# Altium schematic sheet Schematic.SchDoc
size A3; SheetNumber: 1; SheetTotal: 1
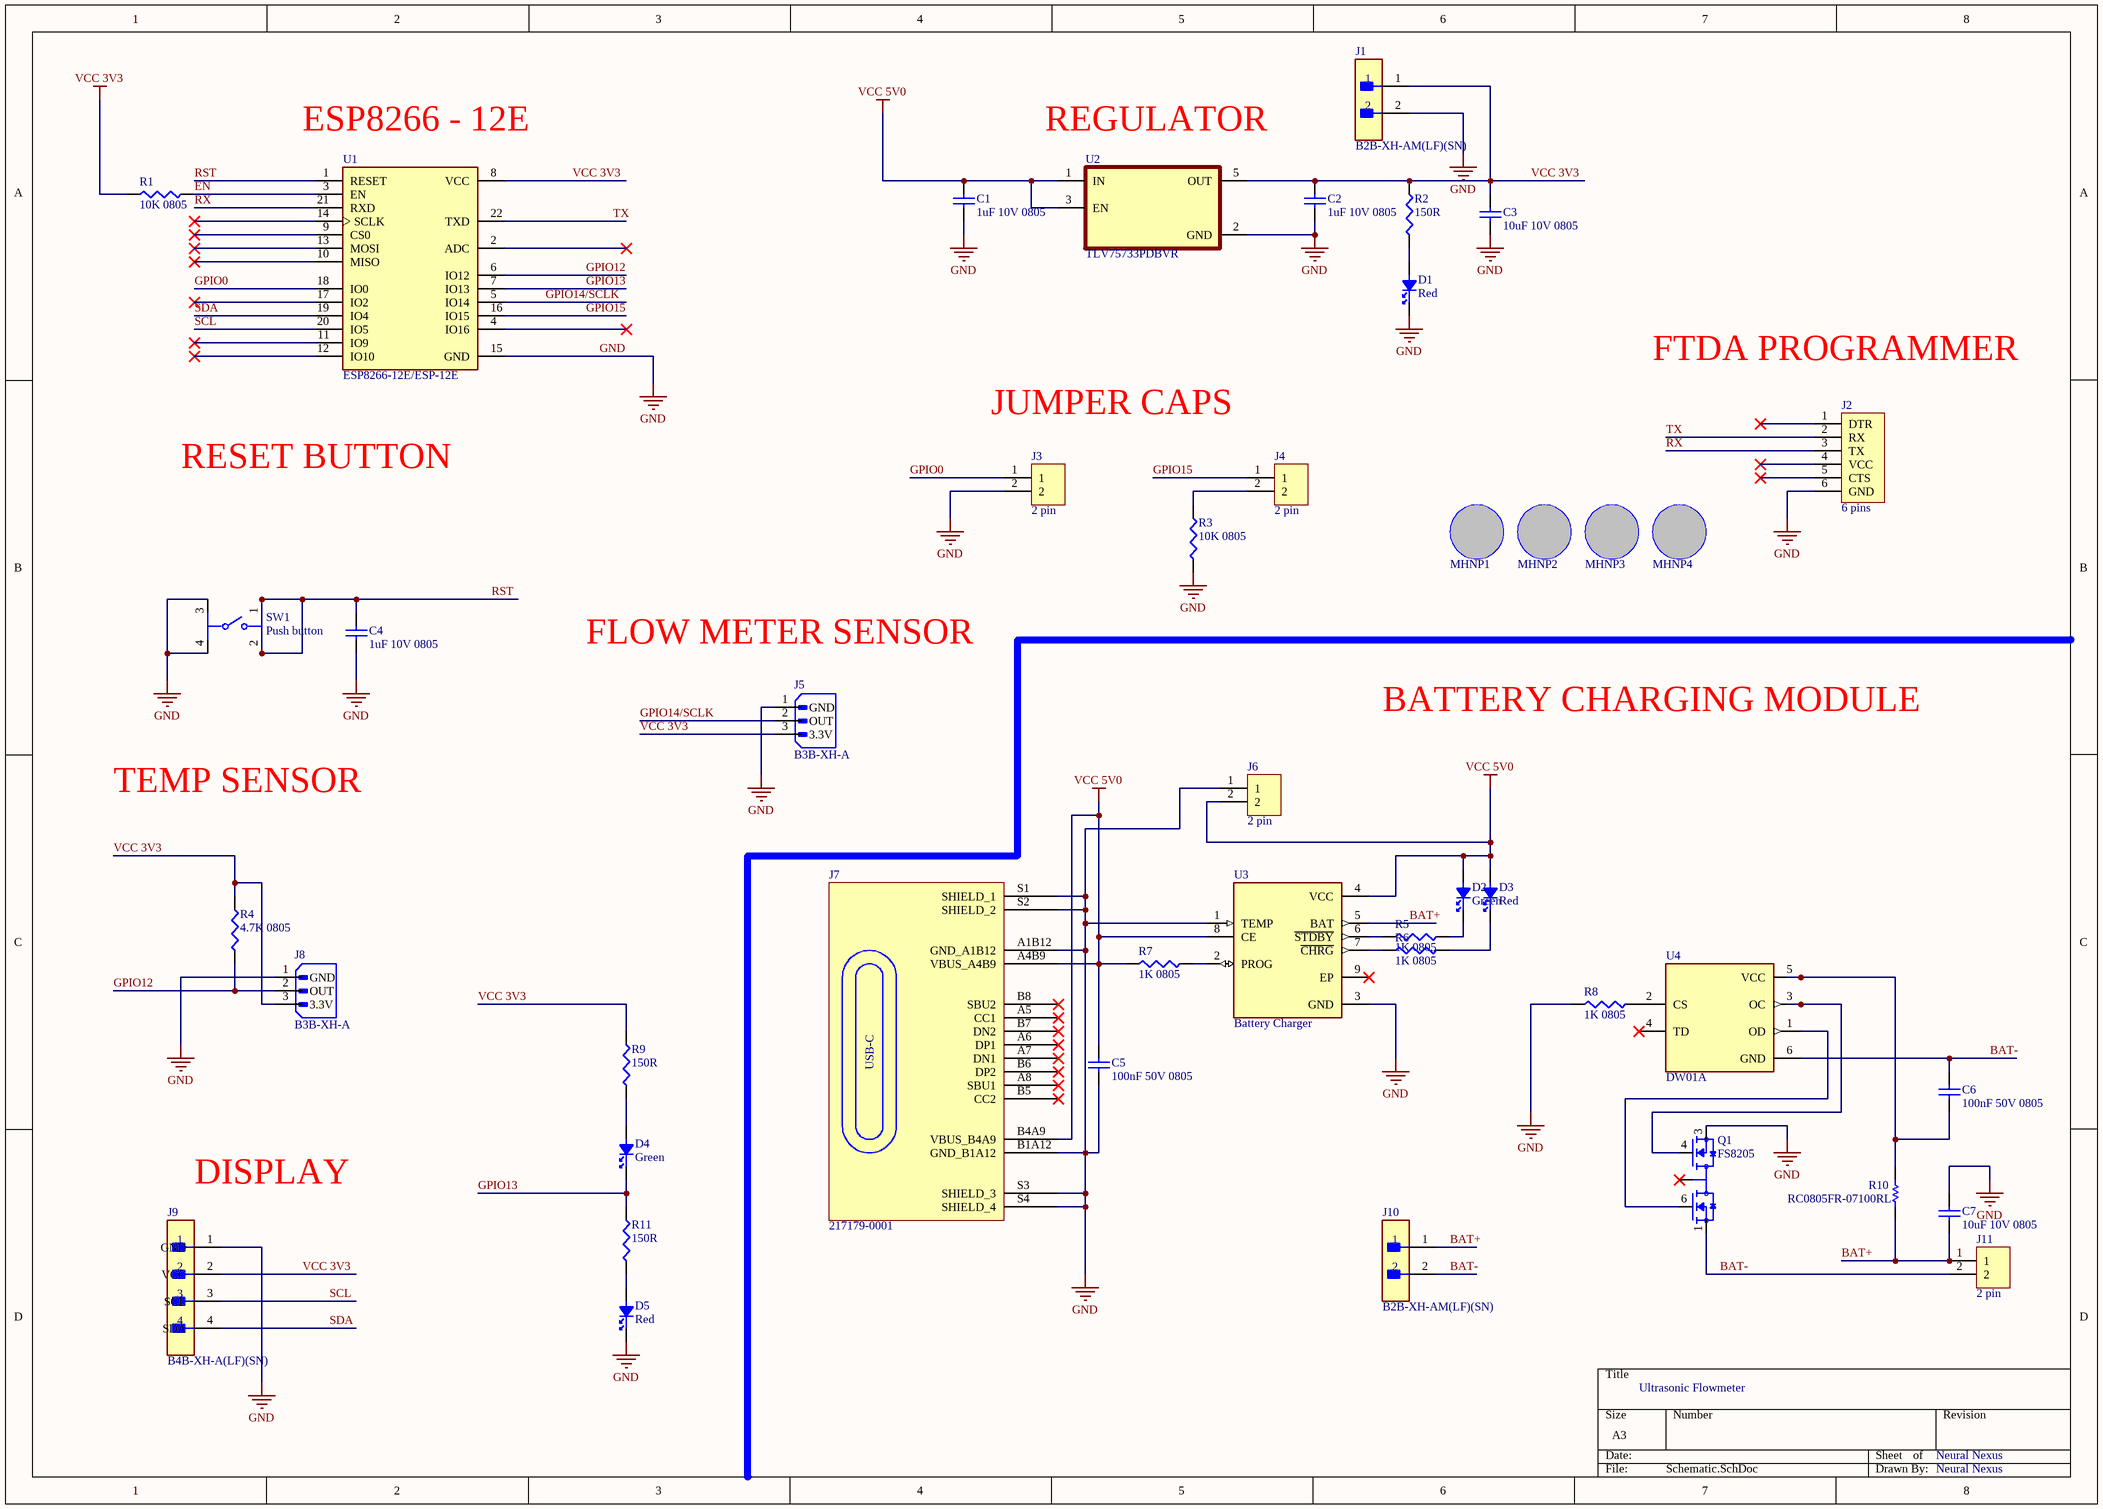
[diagram p0: Schematic.SchDoc]

## Parts
C1  1uF 10V 0805  [CAPC2012X140N]
C2  1uF 10V 0805  [CAPC2012X140N]
C3  10uF 10V 0805  [CAPC2012X140N]
C4  1uF 10V 0805  [CAPC2012X140N]
C5  100nF 50V 0805  [FP-CC0805-0_85-IPC_A]
C6  100nF 50V 0805  [FP-CC0805-0_85-IPC_A]
C7  10uF 10V 0805  [CAPC2012X140N]
D1  Red  [WL-SMCW_1206_150120xx75000 - duplicate]
D2  Green  [WL-SMCW_1206_150120xx75000]
D3  Red  [WL-SMCW_1206_150120xx75000 - duplicate]
D4  Green  [WL-SMCW_1206_150120xx75000]
D5  Red  [WL-SMCW_1206_150120xx75000 - duplicate]
J1  B2B-XH-AM(LF)(SN)  [FP-B2B-XH-AM_LF_SN-MFG]
J2  6 pins  [61300611121]
J3  2 pin  [61300211121]
J4  2 pin  [61300211121]
J5  B3B-XH-A  [JST_B3B-XH-A]
J6  2 pin  [61300211121]
J7  217179-0001  [FP-2171790001-MFG]
J8  B3B-XH-A  [JST_B3B-XH-A]
J9  B4B-XH-A(LF)(SN)  [FP-B4B-XH-A_LF_SN-MFG]
J10  B2B-XH-AM(LF)(SN)  [FP-B2B-XH-AM_LF_SN-MFG]
J11  2 pin  [61300211121]
MHNP1  Mounting Hole Non plated 3.2mm  [MTHNP3P2MM]  (value not drawn)
MHNP2  Mounting Hole Non plated 3.2mm  [MTHNP3P2MM]  (value not drawn)
MHNP3  Mounting Hole Non plated 3.2mm  [MTHNP3P2MM]  (value not drawn)
MHNP4  Mounting Hole Non plated 3.2mm  [MTHNP3P2MM]  (value not drawn)
Q1  FS8205  [SOT95P280X145-6N]
R1  10K 0805  [RESC2012X65N]
R2  150R  [RESC2012X60N]
R3  10K 0805  [RESC2012X65N]
R4  4.7K 0805  [FP-CRGCQ0805-IPC_A]
R5  1K 0805  [RESC2013X60X35NL10T20]
R6  1K 0805  [RESC2013X60X35NL10T20]
R7  1K 0805  [RESC2013X60X35NL10T20]
R8  1K 0805  [RESC2013X60X35NL10T20]
R9  150R  [RESC2012X60N]
R10  RC0805FR-07100RL  [RESC2013X60X35NL10T20]
R11  150R  [RESC2012X60N]
SW1  Push button  [FP-PTS645SH50SMTR92LFS-MFG]
U1  ESP8266-12E/ESP-12E  [XCVR_ESP8266-12E/ESP-12E]
U2  TLV75733PDBVR  [SOT95P280X145-5N]
U3  Battery Charger  [SOP127P600X175-9N]
U4  DW01A  [SOT95P280X145-6N - duplicate]

## Nets
GND: C1.1 C2.1 C3.1 C4.1 C5.1 C7.2 D1.1 D5.1 J1.2 J2.6(GND) J3.2 J5.1(GND) J6.1 J7.A1B12(GND_A1B12) J7.B1A12(GND_B1A12) J7.S1(SHIELD_1) J7.S2(SHIELD_2) J7.S3(SHIELD_3) J7.S4(SHIELD_4) J8.1(GND) J9.1(GND) Q1.3(S2) R3.1 R8.1 SW1.3 SW1.4 U1.15(GND) U2.2(GND) U3.1(TEMP) U3.3(GND)
VCC 3V3: C2.2 C3.2 J1.1 J5.3(3.3V) J8.3(3.3V) J9.2(VCC) R1.1 R2.2 R4.2 R9.2 U1.8(VCC) U2.5(OUT)
VCC 5V0: C1.2 C5.2 D2.2 D3.2 J6.2 J7.A4B9(VBUS_A4B9) J7.B4A9(VBUS_B4A9) R7.1 U2.1(IN) U2.3(EN) U3.4(VCC) U3.8(CE)
BAT+: C7.1 J10.1 J11.1 R10.1 U3.5(BAT)
BAT-: C6.2 J10.2 J11.2 Q1.1(S1) U4.6(GND)
EN: R1.2 U1.3(EN)
GPIO0: J3.1 U1.18(IO0)
GPIO12: J8.2(OUT) R4.1 U1.6(IO12)
GPIO13: D4.1 R11.2 U1.7(IO13)
GPIO14/SCLK: J5.2(OUT) U1.5(IO14)
GPIO15: J4.1 U1.16(IO15)
RST: C4.2 SW1.1 SW1.2 U1.1(RESET)
RX: J2.3(TX) U1.21(RXD)
SCL: J9.3(SCL) U1.20(IO5)
SDA: J9.4(SDA) U1.19(IO4)
TX: J2.2(RX) U1.22(TXD)
NetC6_1: C6.1 R10.2 U4.5(VCC)
NetD1_2: D1.2 R2.1
NetD2_1: D2.1 R5.2
NetD3_1: D3.1 R6.2
NetD4_2: D4.2 R9.1
NetD5_2: D5.2 R11.1
NetJ4_2: J4.2 R3.2
NetQ1_2: Q1.2(D12) Q1.5(D12)
NetQ1_4: Q1.4(G2) U4.3(OC)
NetQ1_6: Q1.6(G1) U4.1(OD)
NetR5_1: R5.1 U3.6(~{STDBY})
NetR6_1: R6.1 U3.7(~{CHRG})
NetR7_2: R7.2 U3.2(PROG)
NetR8_2: R8.2 U4.2(CS)

Not connected (* = marked no-connect by the designer): J2 1(DTR)* 4(VCC)* 5(CTS)*; J7 A5(CC1)* A6(DP1)* A7(DN1)* A8(SBU1)* B5(CC2)* B6(DP2)* B7(DN2)* B8(SBU2)*; U1 2(ADC)* 4(IO16)* 9(CS0)* 10(MISO)* 11(IO9)* 12(IO10)* 13(MOSI)* 14(SCLK)* 17(IO2)*; U3 9(EP)*; U4 4(TD)*

## Notes on the sheet
- (near U1) ESP8266 - 12E
- (near U2) REGULATOR
- FTDA PROGRAMMER
- JUMPER CAPS
- RESET BUTTON
- FLOW METER SENSOR
- BATTERY CHARGING MODULE
- TEMP SENSOR
- DISPLAY
- Ultrasonic Flowmeter
- Neural Nexus
- (in symbol 217179-0001) USB-C

## Library data of the parts
C1 C2 C4 = CL21B105KPFNNNE: CCAP CER 1UF 10V X7R 0805; Manufacturer: Samsung; Dielectric Material: Ceramic; Multilayer: Yes; Tolerance  (fill in as +-): 10%; Supplier: Digikey; Supplier Part Number: 1276-1275-1-ND; Manufacturer Part Number: CL21B105KPFNNNE; RoHS: Yes; Category: Ceramic Capacitors; Stock: 563518; Pricing: 1=0.1, 10=0.041, 100=0.0237, 1000=0.0151 (USD); Mounting Technology: Surface Mount; Pins: 2; Package Shape: Rectangular; Case/Package: 0805; Terminal Finish: Nickel; Min Operating Temperature: -55°C; Max Operating Temperature: 125°C; JESD-609 Code: e3; Value: 1uF; Capacitor Type: Ceramic; Package Style: SMTMeter; Packaging: Tape and Reel; Tolerance (fill in as +-): 10%; Rated DC Voltage (URdc): 10V; Temperature Characteristics Code: X7R; Termination: Wraparound; Length: 2mm; Width: 1.25mm; Height: 1.35mm; Reach SVHC Compliant: Yes; RoHS Compliant: Yes; ComponentLink1URL: https://datasheet.ciiva.com:443/pdfs/VipMasterIC/IC/SEMS/SEMS-S-A0008523501/SEMS-S-A0008523532-1.pdf?src-supplier=IHS+Markit; ComponentLink1Description: https://datasheet.ciiva.com:443/pdfs/VipMasterIC/IC/SEMS/SEMS-S-A0008523501/SEMS-S-A0008523532-1.pdf?src-supplier=IHS+Markit; ComponentLink2URL: https://datasheet.ciiva.com/25799/cl21b105kpfnnne-25799843.pdf?src-supplier=Digikey; ComponentLink2Description: https://datasheet.ciiva.com/25799/cl21b105kpfnnne-25799843.pdf?src-supplier=Digikey; ComponentLink3URL: https://datasheet.ciiva.com/26838/getdatasheetpartid-358362-26838675.pdf?src-supplier=Verical; ComponentLink3Description: https://datasheet.ciiva.com/26838/getdatasheetpartid-358362-26838675.pdf?src-supplier=Verical; ComponentLink4URL: https://datasheet.ciiva.com/16384/cl05b104kq5nnnc-16384501.pdf?src-supplier=Future+Electronics; ComponentLink4Description: https://datasheet.ciiva.com/16384/cl05b104kq5nnnc-16384501.pdf?src-supplier=Future+Electronics
C3 C7 = CL21B106KPQNNNE: Ceramic Capacitor, Multilayer, Ceramic, 10V, 10% +Tol, 10% -Tol, X7R, 15% TC, 10uF, Surface Mount, 0805; Manufacturer: Samsung; Multilayer: Yes; Supplier: Digikey; Supplier Part Number: 1276-1764-1-ND; Manufacturer Part Number: CL21B106KPQNNNE; RoHS: Yes; Category: Ceramic Capacitors; Stock: 679901; Pricing: 1=0.08, 10=0.03, 100=0.0256, 1000=0.02281 (USD); Mounting Technology: Surface Mount; Pins: 2; Dielectric Material: Ceramic; Package Shape: Rectangular; Case/Package: 0805; Terminal Finish: Nickel; Min Operating Temperature: -55°C; Max Operating Temperature: 125°C; JESD-609 Code: e3; Value: 10uF; Capacitor Type: Ceramic; Tolerance  (fill in as +-): 10%; Package Style: SMTMeter; Packaging: Tape and Reel; Tolerance (fill in as +-): 10%; Rated DC Voltage (URdc): 10V; Temperature Characteristics Code: X7R; Termination: Wraparound; Length: 2mm; Width: 1.25mm; Height: 1.4mm; Reach SVHC Compliant: Yes; RoHS Compliant: Yes; ComponentLink1URL: https://datasheet.ciiva.com:443/pdfs/VipMasterIC/IC/SEMS/SEMS-S-A0008384515/SEMS-S-A0008873201-1.pdf?src-supplier=IHS+Markit; ComponentLink1Description: https://datasheet.ciiva.com:443/pdfs/VipMasterIC/IC/SEMS/SEMS-S-A0008384515/SEMS-S-A0008873201-1.pdf?src-supplier=IHS+Markit; ComponentLink2URL: https://datasheet.ciiva.com/25794/cl21b106kpqnnne-25794947.pdf?src-supplier=Digikey; ComponentLink2Description: https://datasheet.ciiva.com/25794/cl21b106kpqnnne-25794947.pdf?src-supplier=Digikey
C5 C6 = CC0805KRX7R9BB104: CAP CER 0.1UF 50V X7R 0805; Manufacturer: Yageo; Dielectric Material: Ceramic; Multilayer: Yes; Tolerance  (fill in as +-): 10%; Supplier: Digikey; Supplier Part Number: 311-1140-1-ND; Manufacturer Part Number: CC0805KRX7R9BB104; RoHS: Yes; Category: Ceramic Capacitors; Stock: 2500824; Pricing: 1=0.08, 10=0.027, 100=0.0192, 1000=0.0136 (USD); Mounting Technology: Surface Mount; Pins: 2; Package Shape: Rectangular; Case/Package: 0805; Terminal Finish: Nickel; Min Operating Temperature: -55°C; Max Operating Temperature: 125°C; JESD-609 Code: e3; Value: 100nF; Capacitor Type: Ceramic; Package Style: SMTMeter; Packaging: Tape and Reel; Tolerance (fill in as +-): 10%; Rated DC Voltage (URdc): 50V; Temperature Characteristics Code: X7R; Termination: Wraparound; Length: 2mm; Width: 1.25mm; Height: 0.85mm; Reach SVHC Compliant: Yes; RoHS Compliant: Yes; ComponentLink1URL: https://datasheet.ciiva.com:443/pdfs/VipMasterIC/IC/YAGO/YAGO-S-A0003557223/YAGO-S-A0003557223-1.pdf?src-supplier=IHS+Markit; ComponentLink1Description: https://datasheet.ciiva.com:443/pdfs/VipMasterIC/IC/YAGO/YAGO-S-A0003557223/YAGO-S-A0003557223-1.pdf?src-supplier=IHS+Markit; ComponentLink2URL: https://datasheet.ciiva.com/11786/0900766b80d84f1d-11786009.pdf?src-supplier=Rs; ComponentLink2Description: https://datasheet.ciiva.com/11786/0900766b80d84f1d-11786009.pdf?src-supplier=Rs; ComponentLink3URL: https://datasheet.ciiva.com/11464/upy-gphc-x7r-6-3v-to-50v-8-11464757.pdf?src-supplier=Avnet; ComponentLink3Description: https://datasheet.ciiva.com/11464/upy-gphc-x7r-6-3v-to-50v-8-11464757.pdf?src-supplier=Avnet; ComponentLink4URL: https://datasheet.ciiva.com/155/mlccorderingcode-155930.pdf?src-supplier=Digikey; ComponentLink4Description: https://datasheet.ciiva.com/155/mlccorderingcode-155930.pdf?src-supplier=Digikey; ComponentLink5URL: https://datasheet.ciiva.com/28450/1489800-28450805.pdf?src-supplier=Element14; ComponentLink5Description: https://datasheet.ciiva.com/28450/1489800-28450805.pdf?src-supplier=Element14; ComponentLink6URL: https://datasheet.ciiva.com/46393/1734573-46393307.pdf?src-supplier=Element14; ComponentLink6Description: https://datasheet.ciiva.com/46393/1734573-46393307.pdf?src-supplier=Element14; ComponentLink7URL: https://datasheet.ciiva.com/155/mlccorderingcode-155929.pdf?src-supplier=Digikey; ComponentLink7Description: https://datasheet.ciiva.com/155/mlccorderingcode-155929.pdf?src-supplier=Digikey; ComponentLink8URL: https://datasheet.ciiva.com/155/mlccorderingcode-155931.pdf?src-supplier=Digikey; ComponentLink8Description: https://datasheet.ciiva.com/155/mlccorderingcode-155931.pdf?src-supplier=Digikey; ComponentLink9URL: https://datasheet.ciiva.com/29242/445210-da-01-en-kerko-chip-0805-x7r-0-1uf-10proz-50vg-29242074.pdf?src-supplier=Conrad; ComponentLink9Description: https://datasheet.ciiva.com/29242/445210-da-01-en-kerko-chip-0805-x7r-0-1uf-10proz-50vg-29242074.pdf?src-supplier=Conrad
D1 D3 D5 = 150120RS75000: Single Color LED, Red, Water Clear, 2mm; Manufacturer: Wurth Electronics; Shape: Rectangular; Forward Current: 30mA; Luminous Intensity-Nom: 150mcd; Channels: 1; Viewing Angle: 140°; Overall Height: 0.68mm; Supplier: Digikey; Supplier Part Number: 732-4991-1-ND; Manufacturer Part Number: 150120RS75000; RoHS: Yes; Category: LEDs; Stock: 39217; Pricing: 1=0.23, 50=0.211, 100=0.182, 500=0.17596 (USD); Mounting Technology: Surface Mount; Pins: 2; Color: Red; Min Operating Temperature: -40°C; Max Operating Temperature: 85°C; Lens Style: WATER CLEAR; Optoelectronic Device Type: SINGLE COLOR LED; Packaging: Tape and Reel; Size: 2mm; Terminal Pitch: 3mm; Reach SVHC Compliant: Yes; RoHS Compliant: Yes; ComponentLink1URL: https://datasheet.ciiva.com:443/pdfs/VipMasterIC/IC/MIDC/MIDC-S-A0007455952/MIDC-S-A0007455952-1.pdf?src-supplier=IHS+Markit; ComponentLink1Description: https://datasheet.ciiva.com:443/pdfs/VipMasterIC/IC/MIDC/MIDC-S-A0007455952/MIDC-S-A0007455952-1.pdf?src-supplier=IHS+Markit; ComponentLink2URL: https://datasheet.ciiva.com/29561/150120rs75000-29561888.pdf?src-supplier=Digikey; ComponentLink2Description: https://datasheet.ciiva.com/29561/150120rs75000-29561888.pdf?src-supplier=Digikey; ComponentLink3URL: https://datasheet.ciiva.com/29279/759442-da-01-en-chipled-1206-w-kl-rot-150120rs75000-29279067.pdf?src-supplier=Conrad; ComponentLink3Description: https://datasheet.ciiva.com/29279/759442-da-01-en-chipled-1206-w-kl-rot-150120rs75000-29279067.pdf?src-supplier=Conrad; ComponentLink4URL: https://datasheet.ciiva.com/48430/150120rs75000-eng-tds-48430054.pdf?src-supplier=Distrelec; ComponentLink4Description: https://datasheet.ciiva.com/48430/150120rs75000-eng-tds-48430054.pdf?src-supplier=Distrelec; ComponentLink5URL: https://datasheet.ciiva.com/22656/1911465-22656982.pdf?src-supplier=Element14; ComponentLink5Description: https://datasheet.ciiva.com/22656/1911465-22656982.pdf?src-supplier=Element14
D2 D4 = 150120VS75000: Single Color LED, Bright Green, Water Clear, 2mm; Manufacturer: Wurth Electronics; Shape: Rectangular; Forward Current: 30mA; Luminous Intensity-Nom: 40mcd; Channels: 1; Viewing Angle: 140°; Overall Height: 0.68mm; Supplier: Digikey; Supplier Part Number: 732-4993-1-ND; Manufacturer Part Number: 150120VS75000; RoHS: Yes; Category: LEDs; Stock: 34329; Pricing: 1=0.23, 50=0.211, 100=0.182, 500=0.17596 (USD); Mounting Technology: Surface Mount; Pins: 2; Color: Green; Min Operating Temperature: -40°C; Max Operating Temperature: 85°C; Lens Style: WATER CLEAR; Optoelectronic Device Type: SINGLE COLOR LED; Packaging: Tape and Reel; Size: 2mm; Terminal Pitch: 3mm; Reach SVHC Compliant: Yes; RoHS Compliant: Yes; ComponentLink1URL: https://datasheet.ciiva.com:443/pdfs/VipMasterIC/IC/MIDC/MIDC-S-A0007455949/MIDC-S-A0007455949-1.pdf?src-supplier=IHS+Markit; ComponentLink1Description: https://datasheet.ciiva.com:443/pdfs/VipMasterIC/IC/MIDC/MIDC-S-A0007455949/MIDC-S-A0007455949-1.pdf?src-supplier=IHS+Markit; ComponentLink2URL: https://datasheet.ciiva.com/29561/150120vs75000-29561865.pdf?src-supplier=Digikey; ComponentLink2Description: https://datasheet.ciiva.com/29561/150120vs75000-29561865.pdf?src-supplier=Digikey; ComponentLink3URL: https://datasheet.ciiva.com/29279/759444-da-01-en-chipled-1206-w-kl-h-gruen-150120vs7500-29279050.pdf?src-supplier=Conrad; ComponentLink3Description: https://datasheet.ciiva.com/29279/759444-da-01-en-chipled-1206-w-kl-h-gruen-150120vs7500-29279050.pdf?src-supplier=Conrad; ComponentLink4URL: https://datasheet.ciiva.com/22656/1911467-22656987.pdf?src-supplier=Element14; ComponentLink4Description: https://datasheet.ciiva.com/22656/1911467-22656987.pdf?src-supplier=Element14; ComponentLink5URL: https://datasheet.ciiva.com/29561/150120vs75000-29561867.pdf?src-supplier=Digikey; ComponentLink5Description: https://datasheet.ciiva.com/29561/150120vs75000-29561867.pdf?src-supplier=Digikey; ComponentLink6URL: https://datasheet.ciiva.com/29561/150120vs75000-29561866.pdf?src-supplier=Digikey; ComponentLink6Description: https://datasheet.ciiva.com/29561/150120vs75000-29561866.pdf?src-supplier=Digikey
J1 J10 = CMP-17439-000037-1: CONN HEADER VERT 2POS 2.5MM; Max Voltage Rating (AC): 250V; Connector Type: Male Pin; Contact Resistance: 20mR; Max Current Rating: 3A; Number of Positions: 2; Series: XH; Contact Material: Brass; Mount: Through Hole; Housing Material: Polyamide; Contact Plating: Tin; Termination: Solder; Max Operating Temperature: 85°C; Depth: 5.75mm; Packaging: Bulk; Min Operating Temperature: -25°C; Contact Type: Male Pin; Color: Green; Pitch: 2.5mm; Length: 7.4mm; Lead Free: Lead Free; Number of Rows: 1; Fastening Type: Detent; Housing Color: White; Orientation: Straight
J2 = 61300611121: Board Connector, 6 Contact(s), 1 Row(s), Male, Straight, 0.1 inch Pitch, Solder Terminal, Locking, Black Insulator, Plug; Manufacturer: Wurth Electronics; Contact Pattern: RECTANGULAR; Contact Resistance: 20mR; Contact Style: SQ PIN-SKT; Dielectric Withstanding Voltage (AC): 500V; Insulation Resistance: 1GR; Number Of Connectors: 1; Rated Current (Signal): 3A; Number of Contacts: 6; Body Length: 0.6inch; Reference Standard: UL; Reliability: COMMERCIAL; Supplier: Digikey; Supplier Part Number: 732-5319-ND; Manufacturer Part Number: 61300611121; RoHS: Yes; Category: Headers and Wire Housings; Stock: 15473; Pricing: 1=0.31, 10=0.268, 25=0.2224, 50=0.1864, 100=0.1683, 1000=0.1539 (USD); Mounting Technology: Board; Contact Material: Copper Alloy; Contact Finish - Mating: GOLD; Contact Finish - Termination: Gold (Au) - with Nickel (Ni) barrier; Insulation Color: Black; Insulation Material: Polybutylene; Min Operating Temperature: -40°C; Max Operating Temperature: 125°C; Connector Type: BOARD CONNECTOR; JESD-609 Code: e4; Body/Shell Style: PLUG; Contact Gender: Male; Mounting Style: STRAIGHT; Number of Rows Loaded: 1; PCB Contact Pattern: RECTANGULAR; Termination: Solder; Body Breadth: 0.1inch; Body Depth: 0.1inch; Mating Contact Pitch: 0.1inch; Mounting Option 1: LOCKING; Terminal Length: 0.118inch; Terminal Pitch: 2.54mm; Reach SVHC Compliant: Yes; RoHS Compliant: Yes; ComponentLink1URL: https://datasheet.ciiva.com:443/pdfs/VipMasterIC/IC/MIDC/MIDCS07676/MIDCS07676-1.pdf?src-supplier=IHS+Markit; ComponentLink1Description: https://datasheet.ciiva.com:443/pdfs/VipMasterIC/IC/MIDC/MIDCS07676/MIDCS07676-1.pdf?src-supplier=IHS+Markit; ComponentLink2URL: http://www.mouser.com/ds/2/445/6130xx11121-538006.pdf?src-supplier=Mouser; ComponentLink2Description: http://www.mouser.com/ds/2/445/6130xx11121-538006.pdf?src-supplier=Mouser; ComponentLink3URL: http://www.farnell.com/cad/1737268.pdf?src-supplier=Element14; ComponentLink3Description: http://www.farnell.com/cad/1737268.pdf?src-supplier=Element14; ComponentLink4URL: https://datasheet.octopart.com/61300611121-W%C3%BCrth-Elektronik-datasheet-21154836.pdf?src-supplier=Element14; ComponentLink4Description: https://datasheet.octopart.com/61300611121-W%C3%BCrth-Elektronik-datasheet-21154836.pdf?src-supplier=Element14; ComponentLink5URL: https://katalog.we-online.de/em/datasheet/6130xx11121.pdf?src-supplier=Digikey; ComponentLink5Description: https://katalog.we-online.de/em/datasheet/6130xx11121.pdf?src-supplier=Digikey
J3 J4 J6 J11 = 61300211121: Board Connector, 2 Contact(s), 1 Row(s), Male, Straight, 0.1 inch Pitch, Solder Terminal, Locking, Black Insulator, Plug; Manufacturer: Wurth Electronics; Option: General Purpose; Contact Pattern: RECTANGULAR; Contact Resistance: 20mR; Contact Style: SQ PIN-SKT; Dielectric Withstanding Voltage (AC): 500V; Filter Feature: No; Insulation Resistance: 1GR; Number Of Connectors: 1; Rated Current (Signal): 3A; Number of Contacts: 2; Body Length: 0.2inch; Reference Standard: UL; Reliability: COMMERCIAL; Supplier: Digikey; Supplier Part Number: 732-5315-ND; Manufacturer Part Number: 61300211121; RoHS: Yes; Category: Headers and Wire Housings; Stock: 191097; Pricing: 1=0.12, 10=0.102, 25=0.0848, 50=0.0712, 100=0.0639, 1000=0.06 (USD); Mounting Technology: Board; Contact Material: Copper Alloy; Contact Finish - Mating: GOLD; Contact Finish - Termination: Gold (Au) - with Nickel (Ni) barrier; Insulation Color: Black; Insulation Material: Polybutylene; Min Operating Temperature: -40°C; Max Operating Temperature: 125°C; Connector Type: BOARD CONNECTOR; JESD-609 Code: e4; Body/Shell Style: PLUG; Contact Gender: Male; Mixed Contacts: No; Mounting Style: STRAIGHT; Number of Rows Loaded: 1; PCB Contact Pattern: RECTANGULAR; Termination: Solder; Body Breadth: 0.1inch; Body Depth: 0.1inch; Mating Contact Pitch: 0.1inch; Mounting Option 1: LOCKING; Terminal Length: 0.118inch; Terminal Pitch: 2.54mm; Flammability Rating: UL94 V-0; Reach SVHC Compliant: Yes; RoHS Compliant: Yes; DIN Conformance: No; IEC Conformance: No; MIL Conformance: No; ComponentLink1URL: https://datasheet.ciiva.com:443/pdfs/VipMasterIC/IC/MIDC/MIDCS07676/MIDCS07676-1.pdf?src-supplier=IHS+Markit; ComponentLink1Description: https://datasheet.ciiva.com:443/pdfs/VipMasterIC/IC/MIDC/MIDCS07676/MIDCS07676-1.pdf?src-supplier=IHS+Markit; ComponentLink2URL: https://datasheet.ciiva.com/13619/6130xx11121-48870-13619345.pdf?src-supplier=Mouser; ComponentLink2Description: https://datasheet.ciiva.com/13619/6130xx11121-48870-13619345.pdf?src-supplier=Mouser
J5 J8 = B3B-XH-A: Connector Header Through Hole 3 position 0.098 (2.50mm); MF: JST Sales; SnapEDA_Link: https://www.snapeda.com/parts/B3B-XH-A/JST+Sales+America+Inc./view-part/?ref=snap; Package: None; Value: *; MP: B3B-XH-A; Check_prices: https://www.snapeda.com/parts/B3B-XH-A/JST+Sales+America+Inc./view-part/?ref=eda
J7 = 217179-0001: CONN RCP USB2.0 TYP C 24P SMD RA; Manufacturer: Molex; Supplier: Digikey; Supplier Part Number: 900-2171790001CT-ND; Manufacturer Part Number: 217179-0001; RoHS: No; Category: Connectors; Stock: 7228; Pricing: 1=0.9, 10=0.745, 100=0.6212 (USD); LCSC Part Number: C3197684
J9 = CMP-17439-000250-1: CONN HEADER VERT 4POS 2.5MM; Number of Contacts: 4; Contact Resistance: 20mR; Voltage Rating: 250V; Max Current Rating: 3A; Gender: Male; Wire/Cable Gauge: 22AWG; Mated Stacking Heights: 9.8mm; Insulation Resistance: 1GR; Orientation: Straight; Contact Type: Male Pin; Contact Finish - Mating: TIN; Series: XH; Max Voltage Rating (AC): 250V; Lead Pitch: 2.5mm; Contact Shape: Square; Insulation Color: Natural; Termination: Solder; Lead Free: Lead Free; Voltage Rating (AC): 250V; Number of Rows: 1; Flammability Rating: UL94 V-0; Number of Positions: 4; Max Operating Temperature: 85°C; Package Quantity: 500; Mount: Through Hole; REACH SVHC: No SVHC; Connector Type: Header; Insulation Material: Nylon; Fastening Type: Detent; Min Operating Temperature: -25°C; Housing Color: White; Packaging: Bulk; Contact Plating: Tin; Contact Material: Brass; Max Voltage Rating (DC): 250V; Housing Material: Polyamide; Color: Natural; Material: Polyamide; Pitch: 2.5mm; Depth: 5.75mm; Current Rating: 3A; Length: 12.4mm
MHNP1-MHNP4 = MTHNP3P2MM
Q1 = FS8205: Dual N-Channel Enhancement Mode Power MOSFET; MF: Fortune Semiconductor; SnapEDA_Link: https://www.snapeda.com/parts/FS8205/Fortune+Semiconductor/view-part/?ref=snap; Package: Package; Value: *; MP: FS8205; Check_prices: https://www.snapeda.com/parts/FS8205/Fortune+Semiconductor/view-part/?ref=eda
R1 R3 = RMCF0805FT10K0: RES 10K OHM 1% 1/8W 0805; MF: {'manufacturer': u'Stackpole Electronics Inc'}; Package: None; Price: None; Value: *; MP: RMCF0805FT10K0; Availability: Unavailable
R2 R9 R11 = RC0805FR-07150RL: Fixed Resistor, Metal Glaze/thick Film, 0.125W, 150ohm, 150V, 1% +/-Tol, 100ppm/Cel, Surface Mount, 0805; Manufacturer: Yageo; Additional Feature: LASER TRIMMABLE; Power: 125mW; Rated Temperature: 70°C; Temperature Coefficient (ppm/Cel): 100; Package Height: 0.5mm; Package Length: 2mm; Package Width: 1.25mm; Supplier: Digikey; Supplier Part Number: 311-150CRCT-ND; Manufacturer Part Number: RC0805FR-07150RL; RoHS: Yes; Category: Chip SMD Resistors; Stock: 933412; Pricing: 1=0.1, 10=0.014, 100=0.0112, 1000=0.00714 (USD); Mounting Technology: Surface Mount; Pins: 2; Package Shape: Rectangular; Case/Package: 0805; Terminal Finish: Nickel; Min Operating Temperature: -55°C; Max Operating Temperature: 155°C; Tolerance: 1%; JESD-609 Code: e3; Resistor Type: FIXED RESISTOR; Construction: Chip; Packaging: Tape and Reel; Value: 150R; Technology: METAL GLAZE/THICK FILM; Termination: Wraparound; Working Voltage: 150V; Reach SVHC Compliant: Yes; RoHS Compliant: Yes; ComponentLink1URL: https://datasheet.ciiva.com:443/pdfs/VipMasterIC/IC/YAGO/YAGO-S-A0008145938/YAGO-S-A0008145938-1.pdf?src-supplier=IHS+Markit; ComponentLink1Description: https://datasheet.ciiva.com:443/pdfs/VipMasterIC/IC/YAGO/YAGO-S-A0008145938/YAGO-S-A0008145938-1.pdf?src-supplier=IHS+Markit; ComponentLink2URL: https://datasheet.ciiva.com/11819/0900766b8106beab-11819782.pdf?src-supplier=Rs; ComponentLink2Description: https://datasheet.ciiva.com/11819/0900766b8106beab-11819782.pdf?src-supplier=Rs; ComponentLink3URL: https://datasheet.ciiva.com/2456/pyu-r-int-thick-7-2456999.pdf?src-supplier=Digikey; ComponentLink3Description: https://datasheet.ciiva.com/2456/pyu-r-int-thick-7-2456999.pdf?src-supplier=Digikey; ComponentLink4URL: https://datasheet.ciiva.com/2457/pyu-r-int-thick-7-2457000.pdf?src-supplier=Digikey; ComponentLink4Description: https://datasheet.ciiva.com/2457/pyu-r-int-thick-7-2457000.pdf?src-supplier=Digikey; ComponentLink5URL: https://datasheet.ciiva.com/2457/pyu-r-int-thick-7-2457001.pdf?src-supplier=Digikey; ComponentLink5Description: https://datasheet.ciiva.com/2457/pyu-r-int-thick-7-2457001.pdf?src-supplier=Digikey; ComponentLink6URL: https://datasheet.ciiva.com/12668/rc0805-12668251.pdf?src-supplier=Mouser; ComponentLink6Description: https://datasheet.ciiva.com/12668/rc0805-12668251.pdf?src-supplier=Mouser; ComponentLink7URL: https://datasheet.ciiva.com/7660/38627-7660798.pdf?src-supplier=Element14; ComponentLink7Description: https://datasheet.ciiva.com/7660/38627-7660798.pdf?src-supplier=Element14; ComponentLink8URL: https://datasheet.ciiva.com/46447/444164-46447566.pdf?src-supplier=Element14; ComponentLink8Description: https://datasheet.ciiva.com/46447/444164-46447566.pdf?src-supplier=Element14
R4 = CRGCQ0805F4K7: Fixed Resistor, Metal Glaze/thick Film, 0.125W, 4700ohm, 150V, 1% +/-Tol, 100ppm/Cel, Surface Mount, 0805; Manufacturer: TE Connectivity; Supplier: Digikey; Supplier Part Number: A129757CT-ND; Manufacturer Part Number: CRGCQ0805F4K7; RoHS: Yes; Category: Chip SMD Resistors; Stock: 634679; Pricing: 1=0.1, 10=0.036, 100=0.0183, 1000=0.01057, 2500=0.00886 (USD); Pins: 2; Resistor Type: FIXED RESISTOR; Reach SVHC Compliant: Yes; RoHS Compliant: Yes; ComponentLink1URL: https://datasheet.ciiva.com:443/pdfs/VipMasterIC/IC/TYEL/TYEL-S-A0004929575/TYEL-S-A0004929575-1.pdf?src-supplier=IHS+Markit; ComponentLink1Description: https://datasheet.ciiva.com:443/pdfs/VipMasterIC/IC/TYEL/TYEL-S-A0004929575/TYEL-S-A0004929575-1.pdf?src-supplier=IHS+Markit; ComponentLink2URL: http://datasheet.octopart.com/CRGCQ0805F4K7-TE-Connectivity-datasheet-114679081.pdf?src-supplier=Mouser; ComponentLink2Description: http://datasheet.octopart.com/CRGCQ0805F4K7-TE-Connectivity-datasheet-114679081.pdf?src-supplier=Mouser; ComponentLink3URL: http://datasheet.octopart.com/CRGCQ0805F4K7-TE-Connectivity-datasheet-114679081.pdf?src-supplier=Verical; ComponentLink3Description: http://datasheet.octopart.com/CRGCQ0805F4K7-TE-Connectivity-datasheet-114679081.pdf?src-supplier=Verical; ComponentLink4URL: http://datasheet.octopart.com/CRGCQ0805F4K7-TE-Connectivity-datasheet-114679081.pdf?src-supplier=Onlinecomponents.com; ComponentLink4Description: http://datasheet.octopart.com/CRGCQ0805F4K7-TE-Connectivity-datasheet-114679081.pdf?src-supplier=Onlinecomponents.com; ComponentLink5URL: http://datasheet.octopart.com/CRGCQ0805F4K7-TE-Connectivity-datasheet-114679081.pdf?src-supplier=Arrow+Electronics; ComponentLink5Description: http://datasheet.octopart.com/CRGCQ0805F4K7-TE-Connectivity-datasheet-114679081.pdf?src-supplier=Arrow+Electronics; ComponentLink6URL: http://datasheet.octopart.com/CRGCQ0805F4K7-TE-Connectivity-datasheet-114679081.pdf?src-supplier=Digikey; ComponentLink6Description: http://datasheet.octopart.com/CRGCQ0805F4K7-TE-Connectivity-datasheet-114679081.pdf?src-supplier=Digikey; ComponentLink7URL: https://www.te.com/commerce/DocumentDelivery/DDEController?Action=srchrtrv&amp;DocNm=1773204-3&amp;DocType=DS&amp;DocLang=English&src-supplier=Digikey; ComponentLink7Description: https://www.te.com/commerce/DocumentDelivery/DDEController?Action=srchrtrv&amp;DocNm=1773204-3&amp;DocType=DS&amp;DocLang=English&src-supplier=Digikey; ComponentLink8URL: http://datasheet.octopart.com/CRGCQ0805F4K7-TE-Connectivity-datasheet-114679081.pdf?src-supplier=Newark; ComponentLink8Description: http://datasheet.octopart.com/CRGCQ0805F4K7-TE-Connectivity-datasheet-114679081.pdf?src-supplier=Newark; ComponentLink9URL: http://datasheet.octopart.com/CRGCQ0805F4K7-TE-Connectivity-datasheet-114679081.pdf?src-supplier=Avnet; ComponentLink9Description: http://datasheet.octopart.com/CRGCQ0805F4K7-TE-Connectivity-datasheet-114679081.pdf?src-supplier=Avnet; ComponentLink10URL: http://datasheet.octopart.com/CRGCQ0805F4K7-TE-Connectivity-datasheet-114679081.pdf?src-supplier=Farnell; ComponentLink10Description: http://datasheet.octopart.com/CRGCQ0805F4K7-TE-Connectivity-datasheet-114679081.pdf?src-supplier=Farnell; ComponentLink11URL: https://4donline.ihs.com/images/VipMasterIC/IC/TYEL/TYEL-S-A0004929575/TYEL-S-A0004929575-1.pdf?hkey=52A5661711E402568146F3353EA87419&src-supplier=Farnell; ComponentLink11Description: https://4donline.ihs.com/images/VipMasterIC/IC/TYEL/TYEL-S-A0004929575/TYEL-S-A0004929575-1.pdf?hkey=52A5661711E402568146F3353EA87419&src-supplier=Farnell; ComponentLink12URL: http://datasheet.octopart.com/CRGCQ0805F4K7-TE-Connectivity-datasheet-114679081.pdf?src-supplier=TME; ComponentLink12Description: http://datasheet.octopart.com/CRGCQ0805F4K7-TE-Connectivity-datasheet-114679081.pdf?src-supplier=TME; ComponentLink13URL: http://datasheet.octopart.com/CRGCQ0805F4K7-TE-Connectivity-datasheet-114679081.pdf?src-supplier=Electro+Sonic; ComponentLink13Description: http://datasheet.octopart.com/CRGCQ0805F4K7-TE-Connectivity-datasheet-114679081.pdf?src-supplier=Electro+Sonic; ComponentLink14URL: http://datasheet.octopart.com/CRGCQ0805F4K7-TE-Connectivity-datasheet-114679081.pdf?src-supplier=Sager+Electronics; ComponentLink14Description: http://datasheet.octopart.com/CRGCQ0805F4K7-TE-Connectivity-datasheet-114679081.pdf?src-supplier=Sager+Electronics; ComponentLink15URL: http://datasheet.octopart.com/CRGCQ0805F4K7-TE-Connectivity-datasheet-114679081.pdf?src-supplier=Heilind+Electronics; ComponentLink15Description: http://datasheet.octopart.com/CRGCQ0805F4K7-TE-Connectivity-datasheet-114679081.pdf?src-supplier=Heilind+Electronics; ComponentLink16URL: https://datasheet.octopart.com/CRGCQ0805F4K7-TE-Connectivity-datasheet-114679081.pdf?src-supplier=Master+Electronics; ComponentLink16Description: https://datasheet.octopart.com/CRGCQ0805F4K7-TE-Connectivity-datasheet-114679081.pdf?src-supplier=Master+Electronics
R5-R8 = RC0805FR-071KL: RES 1K OHM 1% 1/8W 0805; Manufacturer: Yageo; Additional Feature: LASER TRIMMABLE; Power: 125mW; Rated Temperature: 70°C; Value: 1kR; Working Voltage: 150V; Temperature Coefficient (ppm/Cel): 100; Package Height: 0.5mm; Package Length: 2mm; Package Width: 1.25mm; Supplier: Digikey; Supplier Part Number: 311-1.00KCRCT-ND; Manufacturer Part Number: RC0805FR-071KL; RoHS: Yes; Category: Chip SMD Resistors; Stock: 458544; Pricing: 1=0.1, 10=0.012, 100=0.0112, 1000=0.00714 (USD); Mounting Technology: Surface Mount; Pins: 2; Package Shape: Rectangular; Case/Package: 0805; Terminal Finish: Nickel; Min Operating Temperature: -55°C; Max Operating Temperature: 155°C; Tolerance: 1%; JESD-609 Code: e3; Termination: Wraparound; Resistor Type: FIXED RESISTOR; Construction: Chip; Packaging: Tape and Reel; Technology: METAL GLAZE/THICK FILM; Reach SVHC Compliant: Yes; RoHS Compliant: Yes; ComponentLink1URL: https://datasheet.ciiva.com:443/pdfs/VipMasterIC/IC/YAGO/YAGO-S-A0008145938/YAGO-S-A0008145938-1.pdf?src-supplier=IHS+Markit; ComponentLink1Description: https://datasheet.ciiva.com:443/pdfs/VipMasterIC/IC/YAGO/YAGO-S-A0008145938/YAGO-S-A0008145938-1.pdf?src-supplier=IHS+Markit; ComponentLink2URL: https://datasheet.ciiva.com/7941/1686128-7941719.pdf?src-supplier=Element14; ComponentLink2Description: https://datasheet.ciiva.com/7941/1686128-7941719.pdf?src-supplier=Element14; ComponentLink3URL: https://datasheet.ciiva.com/46385/444164-46385020.pdf?src-supplier=Element14; ComponentLink3Description: https://datasheet.ciiva.com/46385/444164-46385020.pdf?src-supplier=Element14; ComponentLink4URL: https://datasheet.ciiva.com/2456/pyu-r-int-thick-7-2456976.pdf?src-supplier=Digikey; ComponentLink4Description: https://datasheet.ciiva.com/2456/pyu-r-int-thick-7-2456976.pdf?src-supplier=Digikey; ComponentLink5URL: https://datasheet.ciiva.com/2456/pyu-r-int-thick-7-2456977.pdf?src-supplier=Digikey; ComponentLink5Description: https://datasheet.ciiva.com/2456/pyu-r-int-thick-7-2456977.pdf?src-supplier=Digikey; ComponentLink6URL: https://datasheet.ciiva.com/2456/pyu-r-int-thick-7-2456975.pdf?src-supplier=Digikey; ComponentLink6Description: https://datasheet.ciiva.com/2456/pyu-r-int-thick-7-2456975.pdf?src-supplier=Digikey; ComponentLink7URL: https://datasheet.ciiva.com/16850/rc0805-16850409.pdf?src-supplier=Future+Electronics; ComponentLink7Description: https://datasheet.ciiva.com/16850/rc0805-16850409.pdf?src-supplier=Future+Electronics
R10 = CMP-2100-03669-1: Chip Resistor, 100 Ohm, +/-1%, 0.125 W, -55 to 155 degC, 0805 (2012 Metric), RoHS, Tape and Reel; Manufacturer: Yageo; Power Rating: 125mW; Resistance: 100Ohm; Voltage Rating: 150V; Tolerance: 1%; Temperature Coefficient: 100ppm/degreesC; Length: 2mm; Package Description: 2-Pin Surface Mounted Device, Body 2 x 1.25 mm; Case Code (Imperial): 0805; Number of Pins: 2; Termination: SMD/SMT; Lead Pitch: 0.4mm; Package Quantity: 1; Height: 0.024inch; Case Code (Metric): 2012; Number of Terminations: 2; Datasheet Version: Rev. 5, 10/2016; Lead Free: LeadFree; Package Reference: 0805; Composition: ThickFilm; REACH SVHC: Unknown; Voltage Rating (DC): 150V; Min Operating Temperature: -55degC; Packaging: TapeandReel; Military Standard: Not; Case/Package: 0805; Datasheet URL: http://www.yageo.com/NewPortal/yageodocoutput?fileName=/pdf/R-Chip/PYu-RC_Group_51_RoHS_L_5.pdf; Max Operating Temperature: 155degC; Manufacturer URL: http://www.yageo.com/; Max Power Dissipation: 125mW; Width: 0.049inch; Depth: 1.25mm; RoHSCompliant: true
SW1 = PTS645SH50SMTR92LFS: SWITCH TACTILE SPST-NO 0.05A 12V; Manufacturer: ITT C&K; Manufacturer Series: PTS645; Contact Current(DC)-Max: 50mA; Contact DC Max Rating R Load: 0.05A@12VDC; Contact Resistance: 0.1mR; Dielectric Withstand Volts: 250VACV; Electrical Life: 100000Cycles; Insulation Resistance: 100GR; PCB Hole Count: 4; Switch Action: MOMENTARY; Switch Function: SPST; Switch Type: Keypad; Body Breadth: 5.9944inch; Body Height: 3.4544mm; Body Length or Diameter: 5.9944mm; Supplier: Digikey; Supplier Part Number: CKN9085CT-ND; Manufacturer Part Number: PTS645SH50SMTR92LFS; RoHS: Yes; Category: Tactile Switches; Stock: 64637; Pricing: 1=0.35, 10=0.337, 25=0.3172, 100=0.2753, 250=0.24972, 500=0.2323 (USD); Mounting Technology: Surface Mount; Terminal Finish: Silver; Min Operating Temperature: -20°C; Max Operating Temperature: 60°C; JESD-609 Code: e4; Actuator Type: Pushbutton; Contact Voltage(DC)-Max: 12V; Termination: Solder; Terminal Length: 0.138inch; Reach SVHC Compliant: Yes; RoHS Compliant: Yes; ComponentLink1URL: https://datasheet.ciiva.com:443/pdfs/VipMasterIC/IC/CKCI/CKCI-S-A0001796527/CKCI-S-A0001796842-1.pdf?src-supplier=IHS+Markit; ComponentLink1Description: https://datasheet.ciiva.com:443/pdfs/VipMasterIC/IC/CKCI/CKCI-S-A0001796527/CKCI-S-A0001796842-1.pdf?src-supplier=IHS+Markit; ComponentLink2URL: https://datasheet.ciiva.com/29903/getdatasheetpartid-773702-29903807.pdf?src-supplier=Verical; ComponentLink2Description: https://datasheet.ciiva.com/29903/getdatasheetpartid-773702-29903807.pdf?src-supplier=Verical; ComponentLink3URL: https://datasheet.ciiva.com/14920/pts645-14920741.pdf?src-supplier=Digikey; ComponentLink3Description: https://datasheet.ciiva.com/14920/pts645-14920741.pdf?src-supplier=Digikey; ComponentLink4URL: https://datasheet.ciiva.com/22637/1707731-22637356.pdf?src-supplier=Element14; ComponentLink4Description: https://datasheet.ciiva.com/22637/1707731-22637356.pdf?src-supplier=Element14; LCSC Part Number: C221869
U1 = ESP8266-12E/ESP-12E: This WiFi module has a 32-bit MCU micro and clock speeds supporting 80 MHz or 160 MHz. Supports the RTOS and integrated Wi-Fi MAC/BB/RF/PA/LNA, and has an on-board antenna.; JLCPCB Part number: *
U2 = TLV75733PDBVR: 1-A, low-IQ high-accuracy low-dropout (LDO) voltage regulator with enable
U3 = TP4056: Complete single cell Li-Ion battery with a constant current / constant voltage linear charger; MF: NanJing Top Power ASIC Corp.; Check_prices: https://www.snapeda.com/parts/TP4056/NanJing+Top+Power+ASIC+Corp./view-part/?ref=eda; SnapEDA_Link: https://www.snapeda.com/parts/TP4056/NanJing+Top+Power+ASIC+Corp./view-part/?ref=snap; Price: None; Availability: Not in stock; Package: Package; MP: TP4056; Value: *
U4 = DW01A: One Cell Lithium-ion/Polymer Battery Protection IC; MF: Fortune Semiconductor; SnapEDA_Link: https://www.snapeda.com/parts/DW01A/Fortune+Semiconductor/view-part/?ref=snap; Package: SOT-23-6 Fortune Semiconductor; Value: *; MP: DW01A; Check_prices: https://www.snapeda.com/parts/DW01A/Fortune+Semiconductor/view-part/?ref=eda